# EAGLE schematic Schema 4 (EAGLE 9.6.2)
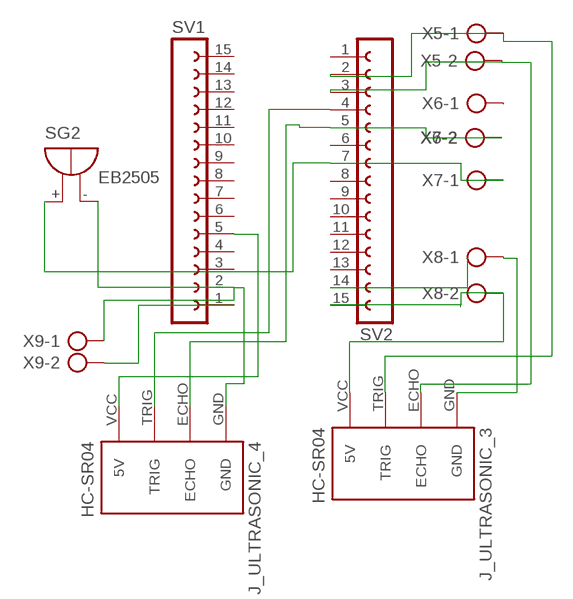
[diagram p0: schematic, sheet 1]

## Parts
J_ULTRASONIC_3  HC-SR04  [HC-SR04_FOOTPRINT]
J_ULTRASONIC_4  HC-SR04  [HC-SR04_FOOTPRINT]
SG2  EB2505  [EB2505]
SV1  FE15-1  [FE15]
SV2  FE15-1  [FE15]
X5  AK300/2  [AK300/2]
X6  AK300/2  [AK300/2]
X7  AK300/2  [AK300/2]
X8  AK300/2  [AK300/2]
X9  AK300/2  [AK300/2]

## Nets
N$5: J_ULTRASONIC_3.TRIG SV2.2 X5.1
N$11: J_ULTRASONIC_3.ECHO SV2.3 X5.2
N$12: J_ULTRASONIC_4.TRIG SV2.4
N$13: J_ULTRASONIC_4.ECHO SV2.5 X6.2 X7.2
N$14: SG2.+ SV2.7 X7.1
N$15: J_ULTRASONIC_3.VCC(5V) SV2.15 X8.2
N$16: J_ULTRASONIC_3.GND X8.1
N$17: J_ULTRASONIC_4.GND SG2.- SV1.2 X9.1
N$18: J_ULTRASONIC_4.VCC(5V) SV1.5
N$19: SV1.1 X9.2
N$20: SV2.14
N$22: X6.1
Unconnected: SV1.3 SV1.4 SV1.6 SV1.7 SV1.8 SV1.9 SV1.10 SV1.11 SV1.12 SV1.13 SV1.14 SV1.15 SV2.1 SV2.6 SV2.8 SV2.9 SV2.10 SV2.11 SV2.12 SV2.13

## Library data of the parts
J_ULTRASONIC_3 J_ULTRASONIC_4 = Ultrasonic Sensor HC-SR04:HC-SR04: Ultrasonic Sensor HC-SR04
SG2 = buzzer:EB2505: BUZZER Source: Buerklin; OC_FARNELL: unknown; OC_NEWARK: unknown
SV1 SV2 = con-lsta:FE15-1: FEMALE HEADER; OC_FARNELL: unknown; OC_NEWARK: unknown
X5-X9 = con-ptr500:AK300/2: CONNECTOR; OC_FARNELL: unknown; OC_NEWARK: unknown